# EAGLE schematic barnabas_noggin_V4 (EAGLE 8.5.0)
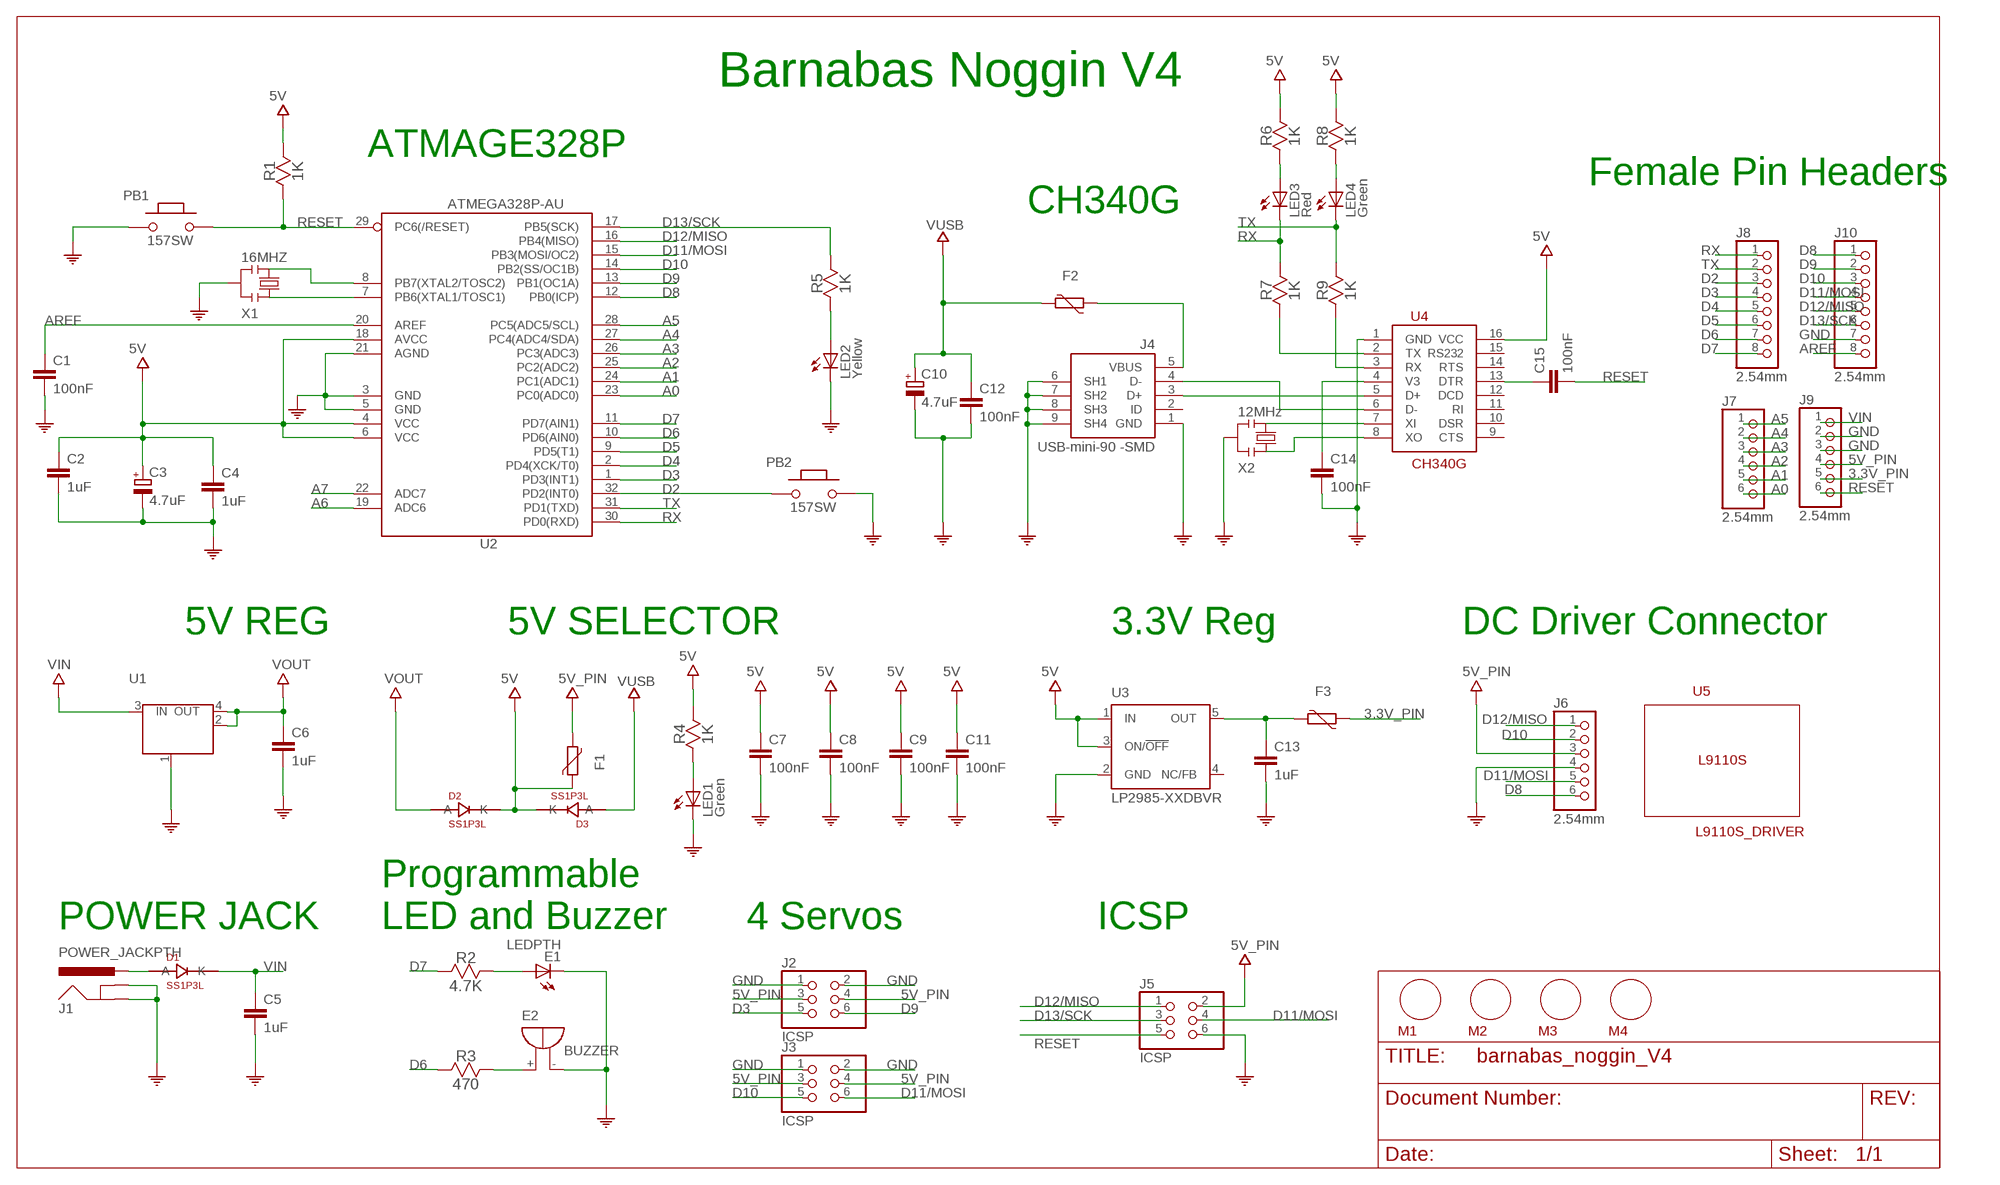
[diagram p0: schematic, sheet 1]

## Parts
C1  100nF  CAPACITOR_100NF_0603  [C0603-ROUND]
C2  1uF  CAPACITOR_1UF_0603  [C0603-ROUND]
C3  4.7uF  CAPACITOR_4.7UF  [TAN-A]
C4  1uF  CAPACITOR_1UF_0603  [C0603-ROUND]
C5  1uF  CAPACITOR_1UF_0603  [C0603-ROUND]
C6  1uF  CAPACITOR_1UF_0603  [C0603-ROUND]
C7  100nF  CAPACITOR_100NF_0603  [C0603-ROUND]
C8  100nF  CAPACITOR_100NF_0603  [C0603-ROUND]
C9  100nF  CAPACITOR_100NF_0603  [C0603-ROUND]
C10  4.7uF  CAPACITOR_4.7UF  [TAN-A]
C11  100nF  CAPACITOR_100NF_0603  [C0603-ROUND]
C12  100nF  CAPACITOR_100NF_0603  [C0603-ROUND]
C13  1uF  CAPACITOR_1UF_0603  [C0603-ROUND]
C14  100nF  CAPACITOR_100NF_0603  [C0603-ROUND]
C15  100nF  CAPACITOR_100NF_0603  [C0603-ROUND]
D1  SS1P3L  SCHOTTKY_DIODE  [DIODI_DO220AAL]
D2  SS1P3L  SCHOTTKY_DIODE  [DIODI_DO220AAL]
D3  SS1P3L  SCHOTTKY_DIODE  [DIODI_DO220AAL]
E1  LEDPTH  [LED5MM]
E2  BUZZER  [BUZZER]
F1  FUSE_6V  [FUSE_0603]
F2  FUSE_6V  [FUSE_0603]
F3  FUSE_6V  [FUSE_0603]
J1  POWER_JACKPTH  [POWER_JACK_PTH]
J2  ICSP  CONNECTOR_2X3  [CONNECTOR_2X3]
J3  ICSP  CONNECTOR_2X3  [CONNECTOR_2X3]
J4  USB-mini-90 -SMD  CONNECTOR_USB_MINI-B  [CONNECTOR_USB_MINI-B]
J5  ICSP  CONNECTOR_2X3  [CONNECTOR_2X3]
J6  2.54mm  PINHD-1X6  [1X06]
J7  2.54mm  PINHD-1X6  [1X06]
J8  2.54mm  PINHD-1X8  [1X08]
J9  2.54mm  PINHD-1X6  [1X06]
J10  2.54mm  PINHD-1X8  [1X08]
LED1  Green  LED_GREEN  [LED_0805]
LED2  Yellow  LED_YELLOW  [LED_0805]
LED3  Red  LED_RED  [LED_0805]
LED4  Green  LED_GREEN  [LED_0805]
M1  MOUNT_HOLE  [MOUNT_HOLE]
M2  MOUNT_HOLE  [MOUNT_HOLE]
M3  MOUNT_HOLE  [MOUNT_HOLE]
M4  MOUNT_HOLE  [MOUNT_HOLE]
PB1  157SW  PUSHBUTTON  [SWITCHES_SMD_157SW]
PB2  157SW  PUSHBUTTON  [SWITCHES_SMD_157SW]
R1  1K  RESISTOR0603  [R0603]
R2  4.7K  RESISTOR  [RESISTOR_PTH]
R3  470  RESISTOR  [RESISTOR_PTH]
R4  1K  RESISTOR0603  [R0603]
R5  1K  RESISTOR0603  [R0603]
R6  1K  RESISTOR0603  [R0603]
R7  1K  RESISTOR0603  [R0603]
R8  1K  RESISTOR0603  [R0603]
R9  1K  RESISTOR0603  [R0603]
U1  LM1117IMPX-5.0  LM1117  [LM1117_SOT223]
U2  ATMEGA328P-AU  ATMEGA328P-32AU  [TQFP32-08]
U3  LP2985-XXDBVR  [SOT23-DBV]
U4  CH340G  [SOIC16]
U5  L9110S_DRIVER  [L9110S_DRIVER]
X1  16MHZ  CRYSTAL_16MHZ  [CRYSTAL]
X2  12MHz  CRYSTAL_12MHZ  [CRYSTAL]

## Nets
3.3V: C13.1 F3.2 U3.5(OUT)
3.3V_PIN: F3.1 J9.5
5V: C2.1 C3.1(+) C4.1 C7.1 C8.1 C9.1 C11.1 D2.P$1(K) D3.P$1(K) F1.1 R1.2 R4.2 R6.2 R8.2 U2.4(VCC) U2.6(VCC) U2.18(AVCC) U3.1(IN) U3.3(ON/!OFF) U4.16(VCC)
5V_PIN: F1.2 J2.3 J2.4 J3.3 J3.4 J5.2 J6.3 J9.4
A0: J7.6 U2.23(PC0(ADC0))
A1: J7.5 U2.24(PC1(ADC1))
A2: J7.4 U2.25(PC2(ADC2))
A3: J7.3 U2.26(PC3(ADC3))
A4: J7.2 U2.27(PC4(ADC4/SDA))
A5: J7.1 U2.28(PC5(ADC5/SCL))
A6: U2.19(ADC6)
A7: U2.22(ADC7)
AREF: C1.1 J10.8 U2.20(AREF)
D2: J8.3 PB2.1 U2.32(PD2(INT0))
D3: J2.5 J8.4 U2.1(PD3(INT1))
D4: J8.5 U2.2(PD4(XCK/T0))
D5: J8.6 U2.9(PD5(T1))
D6: J8.7 R3.1 U2.10(PD6(AIN0))
D7: J8.8 R2.1 U2.11(PD7(AIN1))
D8: J6.6 J10.1 U2.12(PB0(ICP))
D9: J2.6 J10.2 U2.13(PB1(OC1A))
D10: J3.5 J6.2 J10.3 U2.14(PB2(SS/OC1B))
D11/MOSI: J3.6 J5.4 J6.5 J10.4 U2.15(PB3(MOSI/OC2))
D12/MISO: J5.1 J6.1 J10.5 U2.16(PB4(MISO))
D13/SCK: J5.3 J10.6 R5.2 U2.17(PB5(SCK))
GND: C1.2 C2.2 C3.2(-) C4.2 C5.2 C6.2 C7.2 C8.2 C9.2 C10.2(-) C11.2 C12.2 C13.2 C14.2 E1.K(C) E2.- J1.GND J1.GNDBREAK J2.1 J2.2 J3.1 J3.2 J4.1(GND) J4.6(SH1) J4.7(SH2) J4.8(SH3) J4.9(SH4) J5.6 J6.4 J9.2 J9.3 J10.7 LED1.C LED2.C PB1.1 PB2.2 U1.1(GND/ADJ) U2.3(GND) U2.5(GND) U2.21(AGND) U3.2(GND) U4.1(GND) X1.2 X2.2
N$1: U2.8(PB7(XTAL2/TOSC2)) X1.3
N$2: U2.7(PB6(XTAL1/TOSC1)) X1.1
N$3: LED1.A R4.1
N$4: C15.1 U4.13(DTR)
N$5: U4.7(XI) X2.3
N$6: R7.1 U4.2(TX)
N$7: LED3.A R6.1
N$8: R9.1 U4.3(RX)
N$9: LED4.A R8.1
N$10: LED2.A R5.1
N$11: C14.1 U4.4(V3)
N$12: U4.8(XO) X2.1
N$13: J4.3(D+) U4.5(D+)
N$14: J4.4(D-) U4.6(D-)
N$16: D1.P$2(A) J1.PWR
N$17: F2.1 J4.5(VBUS)
N$18: E1.A R2.2
N$19: E2.+ R3.2
RESET: C15.2 J5.5 J9.6 PB1.2 R1.1 U2.29(PC6(/RESET))
RX: J8.1 LED3.C R7.2 U2.30(PD0(RXD))
TX: J8.2 LED4.C R9.2 U2.31(PD1(TXD))
VIN: C5.1 D1.P$1(K) J9.1 U1.3(IN)
VOUT: C6.1 D2.P$2(A) U1.2(OUT) U1.4(OUT)
VUSB: C10.1(+) C12.1 D3.P$2(A) F2.2
Unconnected: J4.2(ID) U3.4(NC/FB) U4.9(CTS) U4.10(DSR) U4.11(RI) U4.12(DCD) U4.14(RTS) U4.15(RS232)

## Notes on the sheet
- Barnabas Noggin V4
- ATMAGE328P
- Female Pin Headers
- CH340G
- 5V REG | 5V SELECTOR | 3.3V Reg | DC Driver Connector
- POWER JACK
- Programmable 
  LED and Buzzer
- 4 Servos | ICSP

## Library data of the parts
C1 C7-C9 C11 C12 C14 C15 = barnabas_noggin_V4:CAPACITOR_100NF_0603: CAP CER 0.1UF 50V Y5V 0603; PARTNO: CC0603ZRY5V9BB104
C2 C4-C6 C13 = barnabas_noggin_V4:CAPACITOR_1UF_0603: 1uF 0603; PARTNO: CC0603KRX5R8BB105
C3 C10 = barnabas_noggin_V4:CAPACITOR_4.7UF: CAP CER 4.7UF 16V X5R 1206; PARTNO: CL31A475KOHNNNE
D1-D3 = barnabas_noggin_V4:SCHOTTKY_DIODE: 1A 30V Schottky Barrier Rectifiers -SS1P3L-M3/84A; PARTNO: SS1P3L-M3/84A
E1 = barnabas_noggin_V4:LEDPTH
E2 = barnabas_noggin_V4:BUZZER: BUZZER Source: Buerklin; OC_FARNELL: unknown; OC_NEWARK: unknown
F1-F3 = barnabas_noggin_V4:FUSE_6V: SMD PTC; PARTNO: MF-FSMF050X-2
J1 = barnabas_noggin_V4:POWER_JACK: Power Jack This is the standard 5.5mm barrel jack for power. The PTH is the most common, proven, reliable, footprint. All others are experimental. The Slot footprint only works if the mill layer is transmitted to the PCB fab house so be warned. Spark Fun Electronics SKU : PRT-00119. Mating wall wart : TOL-00298 (and others); PARTNO: EJ508A
J2 J3 J5 = barnabas_noggin_V4:CONNECTOR_2X3: 3x2 M V h 8,5 mm p2,54; PARTNO: M20-9980346
J4 = barnabas_noggin_V4:CONNECTOR_USB_MINI-B: Usb-Mini F 90 Smd; PARTNO: UJ2-MBH-1-SMT-TR
J6 J7 J9 = barnabas_noggin_V4:PINHD-1X6: PIN HEADER; PARTNO: M20-7820646
J8 J10 = barnabas_noggin_V4:PINHD-1X8: PIN HEADER; PARTNO: PPTC081LFBN-RC
LED1 LED4 = barnabas_noggin_V4:LED_GREEN: LED GREEN - SMD-0805; PARTNO: LTST-C171GKT
LED2 = barnabas_noggin_V4:LED_YELLOW: LED YELLOW - SMD - 0805; PARTNO: LTST-C171KSKT
LED3 = barnabas_noggin_V4:LED_RED: LED RED - SMD - 0805; PARTNO: LTST-C170KRKT
M1-M4 = barnabas_noggin_V4:MOUNT_HOLE
PB1 PB2 = barnabas_noggin_V4:PUSHBUTTON: Pushbutton 4x3 SMD H2,5mm; PARTNO: PTS820 J15M SMTR LFS
R1 R4-R9 = barnabas_noggin_V4:RESISTOR; PARTNO: RC0603FR-071KL
R2 R3 = barnabas_noggin_V4:RESISTOR
U1 = barnabas_noggin_V4:LM1117: Low-dropout linear regulator 5V -LM1117IMPX-5.0; PARTNO: LM1117IMPX-5.0/NOPB
U2 = barnabas_noggin_V4:ATMEGA328P-32: 8-bit Microcontroller with 32KBytes In-System Programmable Flash ATMEGA328P-AU; PARTNO: ATMEGA328P-AU
U3 = barnabas_noggin_V4:LP2985-XXDBVR: ULTRALOW-POWER 50-mA LOW-DROPOUT LINEAR REGULATORS 50-mA Low-Dropout Regulator Source: http://focus.ti.com/lit/ds/symlink/tps77001.pdf; PARTNO: LP2985-33DBVR
U4 = barnabas_noggin_V4:CH340G
U5 = barnabas_noggin_V4:L9110S_DRIVER
X1 = barnabas_noggin_V4:CRYSTAL_16MHZ: 16Mhz - SMD; PARTNO: CSTNE16M0V530000R0
X2 = barnabas_noggin_V4:CRYSTAL_12MHZ; PARTNO: CSTNE12M0G550000R0